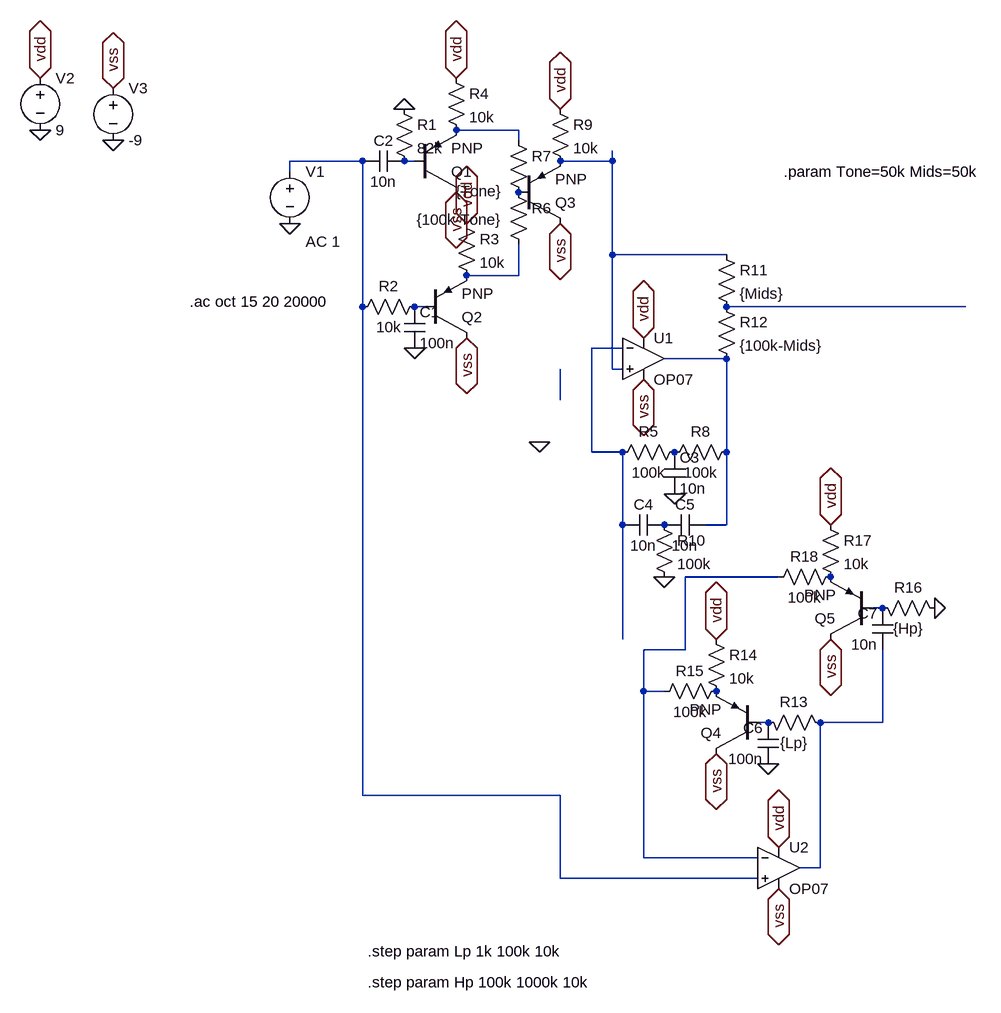
[diagram p0: schematic ToneStackWmids.asc]
ToneStackWmids.asc, the LTspice schematic file:
Version 4
SHEET 1 1140 1376
WIRE 400 48 304 48
WIRE 400 64 400 48
WIRE 160 96 48 96
WIRE 240 96 224 96
WIRE 544 96 544 80
WIRE 544 96 464 96
WIRE 48 112 48 96
WIRE 544 240 544 96
WIRE 720 240 544 240
WIRE 400 272 400 224
WIRE 400 272 320 272
WIRE 160 320 160 96
WIRE 256 320 240 320
WIRE 1088 320 720 320
WIRE 560 384 512 384
WIRE 720 400 624 400
WIRE 544 416 544 240
WIRE 560 416 544 416
WIRE 464 464 464 416
WIRE 512 544 512 384
WIRE 560 544 512 544
WIRE 720 544 720 400
WIRE 560 656 560 544
WIRE 720 656 720 544
WIRE 720 656 688 656
WIRE 800 736 656 736
WIRE 960 784 944 784
WIRE 560 832 560 656
WIRE 656 848 656 736
WIRE 656 848 592 848
WIRE 592 912 592 848
WIRE 624 912 592 912
WIRE 784 960 768 960
WIRE 960 960 960 848
WIRE 960 960 864 960
WIRE 160 1072 160 320
WIRE 464 1072 160 1072
WIRE 592 1168 592 912
WIRE 768 1168 592 1168
WIRE 864 1184 864 960
WIRE 864 1184 832 1184
WIRE 464 1200 464 1072
WIRE 768 1200 464 1200
FLAG 48 192 0
FLAG 240 384 0
FLAG 224 16 0
FLAG -224 64 0
FLAG -336 48 0
FLAG -336 -32 vdd
IOPIN -336 -32 BiDir
FLAG 592 368 vdd
IOPIN 592 368 BiDir
FLAG -224 -16 vss
IOPIN -224 -16 BiDir
FLAG 592 432 vss
IOPIN 592 432 BiDir
FLAG 304 -32 vdd
IOPIN 304 -32 BiDir
FLAG 304 144 vss
IOPIN 304 144 BiDir
FLAG 320 192 vdd
IOPIN 320 192 BiDir
FLAG 320 368 vss
IOPIN 320 368 BiDir
FLAG 464 192 vss
IOPIN 464 192 BiDir
FLAG 464 16 vdd
IOPIN 464 16 BiDir
FLAG 640 608 0
FLAG 624 736 0
FLAG 432 528 0
FLAG 800 1152 vdd
IOPIN 800 1152 BiDir
FLAG 800 1216 vss
IOPIN 800 1216 BiDir
FLAG 784 1024 0
FLAG 704 1008 vss
IOPIN 704 1008 BiDir
FLAG 704 832 vdd
IOPIN 704 832 BiDir
FLAG 880 832 vss
IOPIN 880 832 BiDir
FLAG 880 656 vdd
IOPIN 880 656 BiDir
FLAG 1040 784 0
SYMBOL voltage 48 96 R0
WINDOW 123 24 124 Left 2
WINDOW 39 0 0 Left 0
SYMATTR InstName V1
SYMATTR Value ""
SYMATTR Value2 AC 1
SYMBOL res 256 304 R90
WINDOW 0 0 56 VBottom 2
WINDOW 3 32 56 VTop 2
SYMATTR InstName R2
SYMATTR Value 10k
SYMBOL cap 224 320 R0
SYMATTR InstName C1
SYMATTR Value 100n
SYMBOL cap 224 80 R90
WINDOW 0 0 32 VBottom 2
WINDOW 3 32 32 VTop 2
SYMATTR InstName C2
SYMATTR Value 10n
SYMBOL res 208 0 R0
SYMATTR InstName R1
SYMATTR Value 82k
SYMBOL Opamps\\OP07 592 336 R0
SYMATTR InstName U1
SYMBOL voltage -336 -48 R0
WINDOW 123 0 0 Left 0
WINDOW 39 0 0 Left 0
SYMATTR InstName V2
SYMATTR Value 9
SYMBOL voltage -224 -32 R0
WINDOW 123 0 0 Left 0
WINDOW 39 0 0 Left 0
SYMATTR InstName V3
SYMATTR Value -9
SYMBOL pnp 240 144 M180
SYMATTR InstName Q1
SYMBOL pnp 256 368 M180
SYMATTR InstName Q2
SYMBOL res 304 176 R0
SYMATTR InstName R3
SYMATTR Value 10k
SYMBOL res 288 -48 R0
SYMATTR InstName R4
SYMATTR Value 10k
SYMBOL res 384 128 R0
WINDOW 3 -141 58 Left 2
SYMATTR InstName R6
SYMATTR Value {100k-Tone}
SYMBOL res 384 48 R0
WINDOW 3 -81 94 Left 2
SYMATTR InstName R7
SYMATTR Value {Tone}
SYMBOL pnp 400 192 M180
SYMATTR InstName Q3
SYMBOL res 448 0 R0
SYMATTR InstName R9
SYMATTR Value 10k
SYMBOL res 656 528 R90
WINDOW 0 0 56 VBottom 2
WINDOW 3 32 56 VTop 2
SYMATTR InstName R5
SYMATTR Value 100k
SYMBOL res 736 528 R90
WINDOW 0 0 56 VBottom 2
WINDOW 3 32 56 VTop 2
SYMATTR InstName R8
SYMATTR Value 100k
SYMBOL cap 624 544 R0
SYMATTR InstName C3
SYMATTR Value 10n
SYMBOL cap 624 640 R90
WINDOW 0 0 32 VBottom 2
WINDOW 3 32 32 VTop 2
SYMATTR InstName C4
SYMATTR Value 10n
SYMBOL cap 688 640 R90
WINDOW 0 0 32 VBottom 2
WINDOW 3 32 32 VTop 2
SYMATTR InstName C5
SYMATTR Value 10n
SYMBOL res 608 640 R0
SYMATTR InstName R10
SYMATTR Value 100k
SYMBOL res 704 224 R0
SYMATTR InstName R11
SYMATTR Value {Mids}
SYMBOL res 704 304 R0
SYMATTR InstName R12
SYMATTR Value {100k-Mids}
SYMBOL Opamps\\OP07 800 1120 R0
SYMATTR InstName U2
SYMBOL res 768 944 M90
WINDOW 0 0 56 VBottom 2
WINDOW 3 32 56 VTop 2
SYMATTR InstName R13
SYMATTR Value {Lp}
SYMBOL cap 800 960 M0
SYMATTR InstName C6
SYMATTR Value 100n
SYMBOL pnp 768 1008 R180
SYMATTR InstName Q4
SYMBOL res 688 816 R0
SYMATTR InstName R14
SYMATTR Value 10k
SYMBOL res 720 896 R90
WINDOW 0 0 56 VBottom 2
WINDOW 3 32 56 VTop 2
SYMATTR InstName R15
SYMATTR Value 100k
SYMBOL res 944 768 M90
WINDOW 0 0 56 VBottom 2
WINDOW 3 32 56 VTop 2
SYMATTR InstName R16
SYMATTR Value {Hp}
SYMBOL cap 976 784 M0
SYMATTR InstName C7
SYMATTR Value 10n
SYMBOL pnp 944 832 R180
SYMATTR InstName Q5
SYMBOL res 864 640 R0
SYMATTR InstName R17
SYMATTR Value 10k
SYMBOL res 896 720 R90
WINDOW 0 0 56 VBottom 2
WINDOW 3 32 56 VTop 2
SYMATTR InstName R18
SYMATTR Value 100k
TEXT -106 312 Left 2 !.ac oct 15 20 20000
TEXT 168 1312 Left 2 !.step param Lp 1k 100k 10k
TEXT 168 1360 Left 2 !.step param Hp 100k 1000k 10k
TEXT 808 112 Left 2 !.param Tone=50k Mids=50k

The netlist it stands for:
* ToneStackWmids.asc
V1 N002 0 AC 1
R2 N006 N002 10k
C1 N006 0 100n
C2 N003 N002 10n
R1 0 N003 82k
XU1 N004 N008 vdd vss N009 LT1001  ; OP07, pins In+ In- V+ V- OUT
V2 vdd 0 9
V3 vss 0 -9
Q1 vss N003 N001 0 PNP
Q2 vss N006 N005 0 PNP
R3 vdd N005 10k
R4 vdd N001 10k
R6 P001 N005 {100k-Tone}
R7 N001 P001 {Tone}
Q3 vss P001 N004 0 PNP
R9 vdd N004 10k
R5 P002 N008 100k
R8 N009 P002 100k
C3 P002 0 10n
C4 P003 N008 10n
C5 N009 P003 10n
R10 P003 0 100k
R11 N004 N007 {Mids}
R12 N007 N009 {100k-Mids}
XU2 N002 N011 vdd vss N014 LT1001  ; OP07, pins In+ In- V+ V- OUT
R13 N013 N014 {Lp}
C6 N013 0 100n
Q4 vss N013 P004 0 PNP
R14 vdd P004 10k
R15 P004 N011 100k
R16 N012 0 {Hp}
C7 N012 N014 10n
Q5 vss N012 P005 0 PNP
R17 vdd P005 10k
R18 P005 N011 100k
.model NPN NPN
.model PNP PNP
.lib standard.bjt
.ac oct 15 20 20000
.step param Lp 1k 100k 10k
.step param Hp 100k 1000k 10k
.param Tone=50k Mids=50k
.lib LTC.lib
.backanno
.end